# Altium schematic sheet Banker.schdoc: Banker
size 420 x 297 mm; Author: G.K.; CompanyName: WUT; DrawnBy: G.K.; Organization: CERN; Address1: Warsaw Univeristy of Technology; Address2: Nowowiejska 15/19; DocumentNumber: 1; Revision: -; SheetNumber: 1; SheetTotal: 9; EDA_Number: ARTIQ; Projet: Banker; ModifiedBy: -; CreateDate: XX/XX/XXXX; CheckedDate: -; Title2: Top; DivGrp: ISE; Designer: G.K.; ModifiedDate: -; ProjectName: ADC/DAC MEZZANINE
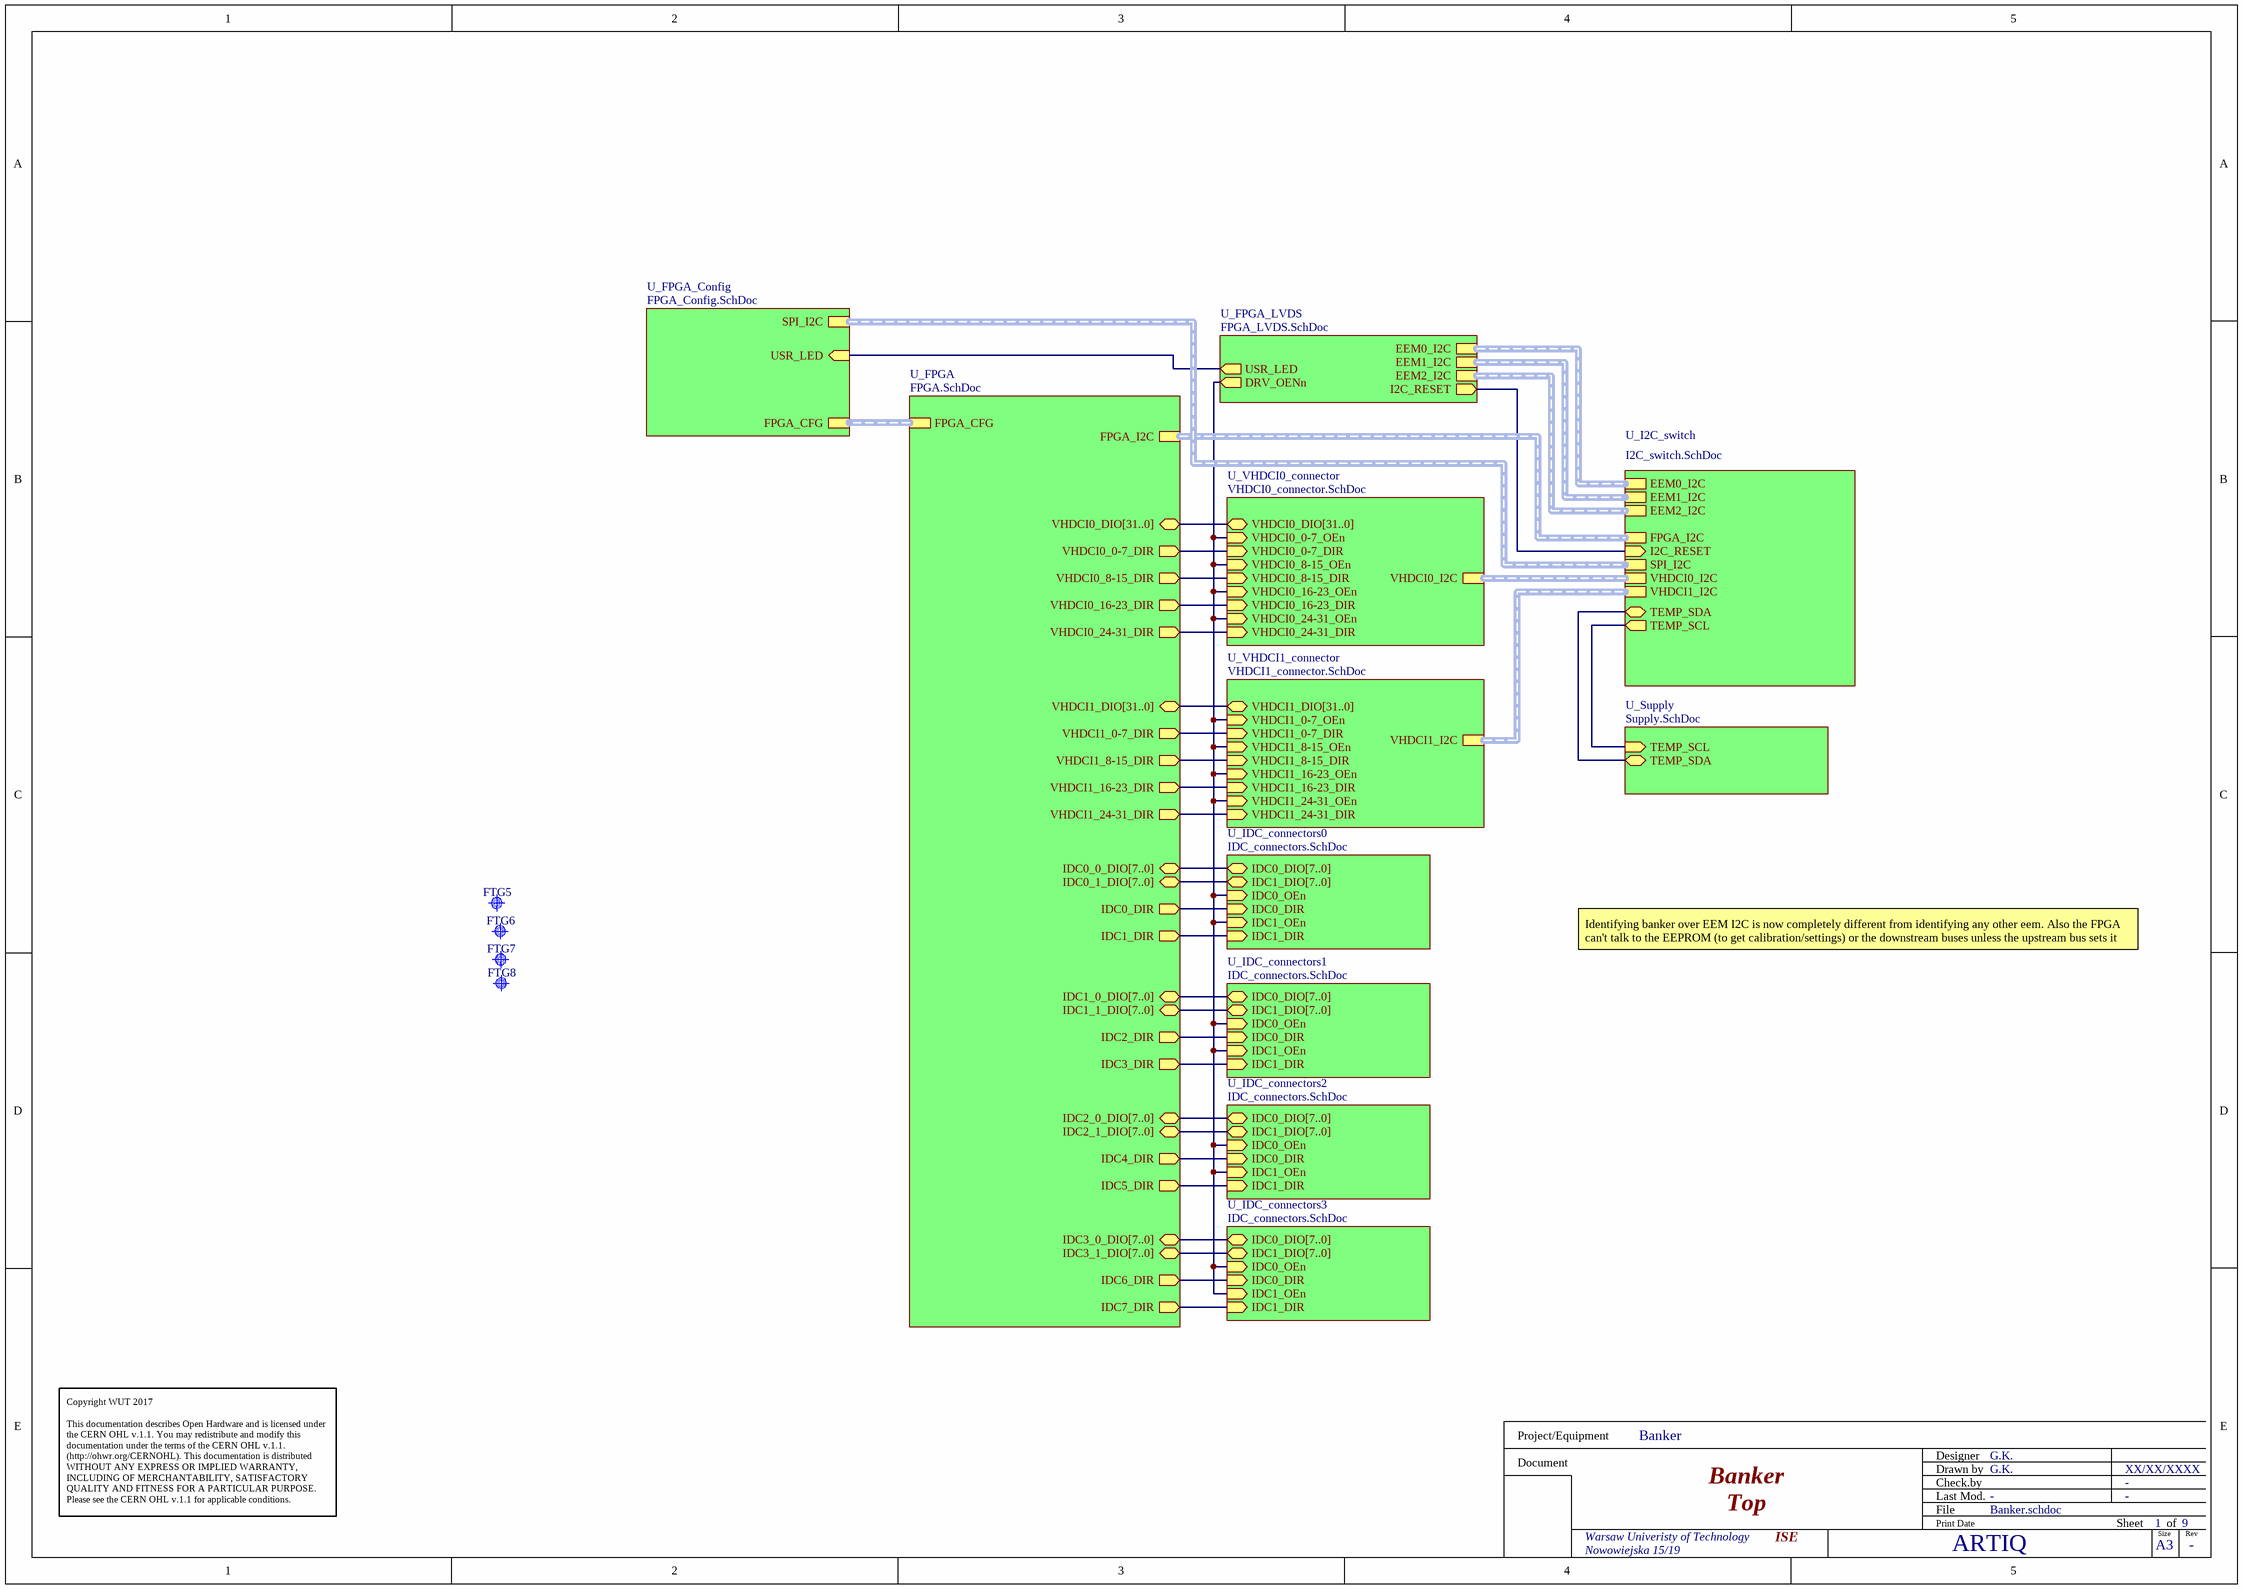
[diagram p0: Banker.schdoc]

## Parts
FTG5  Use only in PCB  [FIDUCIAL_TOP_C100-200]  (value not drawn)
FTG6  Use only in PCB  [FIDUCIAL_TOP_S100-200]  (value not drawn)
FTG7  Use only in PCB  [FIDUCIAL_TOP_S200-400]  (value not drawn)
FTG8  Use only in PCB  [FIDUCIAL_TOP_S100-200]  (value not drawn)

## Sub-sheets
U_FPGA = FPGA.SchDoc: VHDCI0_DIO[31..0] (bidir), VHDCI1_DIO[31..0] (bidir), IDC0_0_DIO[7..0] (bidir), IDC0_1_DIO[7..0] (bidir), IDC0_DIR (out), IDC1_DIR (out), VHDCI1_0-7_DIR (out), VHDCI1_8-15_DIR (out), VHDCI1_16-23_DIR (out), VHDCI1_24-31_DIR (out), VHDCI0_0-7_DIR (out), VHDCI0_8-15_DIR (out), VHDCI0_16-23_DIR (out), VHDCI0_24-31_DIR (out), IDC2_DIR (out), IDC3_DIR (out), IDC1_0_DIO[7..0] (bidir), IDC1_1_DIO[7..0] (bidir), IDC2_0_DIO[7..0] (bidir), IDC2_1_DIO[7..0] (bidir), IDC3_0_DIO[7..0] (bidir), IDC3_1_DIO[7..0] (bidir), IDC7_DIR (out), IDC6_DIR (out), IDC4_DIR (out), IDC5_DIR (out), FPGA_I2C (harness I2C), FPGA_CFG (harness FPGA_CFG)
U_FPGA_Config = FPGA_Config.SchDoc: FPGA_CFG (harness FPGA_CFG), SPI_I2C (harness I2C), USR_LED (in)
U_FPGA_LVDS = FPGA_LVDS.SchDoc: EEM0_I2C (harness I2C), EEM1_I2C (harness I2C), EEM2_I2C (harness I2C), USR_LED (out), I2C_RESET (out), DRV_OENn (out)
U_I2C_switch = I2C_switch.SchDoc: EEM0_I2C (harness I2C), EEM1_I2C (harness I2C), VHDCI0_I2C (harness I2C), VHDCI1_I2C (harness I2C), EEM2_I2C (harness I2C), FPGA_I2C (harness I2C), SPI_I2C (harness I2C), I2C_RESET (in), TEMP_SCL (out), TEMP_SDA (bidir)
U_IDC_connectors0 = IDC_connectors.SchDoc: IDC0_DIO[7..0] (bidir), IDC1_DIO[7..0] (bidir), IDC0_OEn (in), IDC0_DIR (in), IDC1_DIR (in), IDC1_OEn (in)
U_IDC_connectors1 = IDC_connectors.SchDoc: IDC0_DIO[7..0] (bidir), IDC1_DIO[7..0] (bidir), IDC0_OEn (in), IDC0_DIR (in), IDC1_DIR (in), IDC1_OEn (in)
U_IDC_connectors2 = IDC_connectors.SchDoc: IDC0_DIO[7..0] (bidir), IDC1_DIO[7..0] (bidir), IDC0_OEn (in), IDC0_DIR (in), IDC1_DIR (in), IDC1_OEn (in)
U_IDC_connectors3 = IDC_connectors.SchDoc: IDC0_DIO[7..0] (bidir), IDC1_DIO[7..0] (bidir), IDC0_OEn (in), IDC0_DIR (in), IDC1_DIR (in), IDC1_OEn (in)
U_Supply = Supply.SchDoc: TEMP_SCL (in), TEMP_SDA (bidir)
U_VHDCI0_connector = VHDCI0_connector.SchDoc: VHDCI0_I2C (harness I2C), VHDCI0_DIO[31..0] (bidir), VHDCI0_0-7_OEn (in), VHDCI0_0-7_DIR (in), VHDCI0_8-15_OEn (in), VHDCI0_8-15_DIR (in), VHDCI0_16-23_OEn (in), VHDCI0_16-23_DIR (in), VHDCI0_24-31_OEn (in), VHDCI0_24-31_DIR (in)
U_VHDCI1_connector = VHDCI1_connector.SchDoc: VHDCI1_DIO[31..0] (bidir), VHDCI1_I2C (harness I2C), VHDCI1_0-7_OEn (in), VHDCI1_0-7_DIR (in), VHDCI1_8-15_OEn (in), VHDCI1_8-15_DIR (in), VHDCI1_16-23_OEn (in), VHDCI1_16-23_DIR (in), VHDCI1_24-31_OEn (in), VHDCI1_24-31_DIR (in)

## Nets
(unnamed): sheet U_FPGA_LVDS/USR_LED, sheet U_FPGA_Config/USR_LED
(unnamed): sheet U_FPGA_LVDS/I2C_RESET, sheet U_I2C_switch/I2C_RESET
(unnamed): sheet U_FPGA_LVDS/DRV_OENn, sheet U_VHDCI0_connector/VHDCI0_0-7_OEn, sheet U_VHDCI0_connector/VHDCI0_8-15_OEn, sheet U_VHDCI0_connector/VHDCI0_16-23_OEn, sheet U_VHDCI0_connector/VHDCI0_24-31_OEn, sheet U_IDC_connectors0/IDC0_OEn, sheet U_IDC_connectors0/IDC1_OEn, sheet U_VHDCI1_connector/VHDCI1_0-7_OEn, sheet U_VHDCI1_connector/VHDCI1_8-15_OEn, sheet U_VHDCI1_connector/VHDCI1_16-23_OEn, sheet U_VHDCI1_connector/VHDCI1_24-31_OEn, sheet U_IDC_connectors1/IDC0_OEn, sheet U_IDC_connectors1/IDC1_OEn, sheet U_IDC_connectors2/IDC0_OEn, sheet U_IDC_connectors2/IDC1_OEn, sheet U_IDC_connectors3/IDC0_OEn, sheet U_IDC_connectors3/IDC1_OEn
(unnamed): sheet U_VHDCI0_connector/VHDCI0_0-7_DIR, sheet U_FPGA/VHDCI0_0-7_DIR
(unnamed): sheet U_VHDCI0_connector/VHDCI0_8-15_DIR, sheet U_FPGA/VHDCI0_8-15_DIR
(unnamed): sheet U_VHDCI0_connector/VHDCI0_16-23_DIR, sheet U_FPGA/VHDCI0_16-23_DIR
(unnamed): sheet U_VHDCI0_connector/VHDCI0_24-31_DIR, sheet U_FPGA/VHDCI0_24-31_DIR
(unnamed): sheet U_IDC_connectors0/IDC0_DIR, sheet U_FPGA/IDC0_DIR
(unnamed): sheet U_IDC_connectors0/IDC1_DIR, sheet U_FPGA/IDC1_DIR
(unnamed): sheet U_VHDCI1_connector/VHDCI1_0-7_DIR, sheet U_FPGA/VHDCI1_0-7_DIR
(unnamed): sheet U_VHDCI1_connector/VHDCI1_8-15_DIR, sheet U_FPGA/VHDCI1_8-15_DIR
(unnamed): sheet U_VHDCI1_connector/VHDCI1_16-23_DIR, sheet U_FPGA/VHDCI1_16-23_DIR
(unnamed): sheet U_VHDCI1_connector/VHDCI1_24-31_DIR, sheet U_FPGA/VHDCI1_24-31_DIR
(unnamed): sheet U_IDC_connectors1/IDC0_DIR, sheet U_FPGA/IDC2_DIR
(unnamed): sheet U_IDC_connectors1/IDC1_DIR, sheet U_FPGA/IDC3_DIR
(unnamed): sheet U_IDC_connectors2/IDC0_DIR, sheet U_FPGA/IDC4_DIR
(unnamed): sheet U_IDC_connectors2/IDC1_DIR, sheet U_FPGA/IDC5_DIR
(unnamed): sheet U_IDC_connectors3/IDC0_DIR, sheet U_FPGA/IDC6_DIR
(unnamed): sheet U_IDC_connectors3/IDC1_DIR, sheet U_FPGA/IDC7_DIR
(unnamed): sheet U_I2C_switch/TEMP_SCL, sheet U_Supply/TEMP_SCL
(unnamed): sheet U_I2C_switch/TEMP_SDA, sheet U_Supply/TEMP_SDA

## Buses and harness runs
bus sheet U_FPGA/IDC0_0_DIO[7..0] = sheet U_IDC_connectors0/IDC0_DIO[7..0]
bus sheet U_FPGA/IDC0_1_DIO[7..0] = sheet U_IDC_connectors0/IDC1_DIO[7..0]
bus sheet U_FPGA/IDC1_0_DIO[7..0] = sheet U_IDC_connectors1/IDC0_DIO[7..0]
bus sheet U_FPGA/IDC1_1_DIO[7..0] = sheet U_IDC_connectors1/IDC1_DIO[7..0]
bus sheet U_FPGA/IDC2_0_DIO[7..0] = sheet U_IDC_connectors2/IDC0_DIO[7..0]
bus sheet U_FPGA/IDC2_1_DIO[7..0] = sheet U_IDC_connectors2/IDC1_DIO[7..0]
bus sheet U_FPGA/IDC3_0_DIO[7..0] = sheet U_IDC_connectors3/IDC0_DIO[7..0]
bus sheet U_FPGA/IDC3_1_DIO[7..0] = sheet U_IDC_connectors3/IDC1_DIO[7..0]
bus sheet U_FPGA/VHDCI0_DIO[31..0] = sheet U_VHDCI0_connector/VHDCI0_DIO[31..0]
bus sheet U_FPGA/VHDCI1_DIO[31..0] = sheet U_VHDCI1_connector/VHDCI1_DIO[31..0]
harness sheet U_FPGA/FPGA_CFG = sheet U_FPGA_Config/FPGA_CFG
harness sheet U_FPGA/FPGA_I2C = sheet U_I2C_switch/FPGA_I2C
harness sheet U_FPGA_Config/SPI_I2C = sheet U_I2C_switch/SPI_I2C
harness sheet U_FPGA_LVDS/EEM0_I2C = sheet U_I2C_switch/EEM0_I2C
harness sheet U_FPGA_LVDS/EEM1_I2C = sheet U_I2C_switch/EEM1_I2C
harness sheet U_FPGA_LVDS/EEM2_I2C = sheet U_I2C_switch/EEM2_I2C
harness sheet U_I2C_switch/VHDCI0_I2C = sheet U_VHDCI0_connector/VHDCI0_I2C
harness sheet U_I2C_switch/VHDCI1_I2C = sheet U_VHDCI1_connector/VHDCI1_I2C

## Notes on the sheet
- Identifying banker over EEM I2C is now completely different from identifying any other eem. Also the FPGA can't talk to the EEPROM (to get calibration/settings) or the downstream buses unless the upstream bus sets it up.
- Copyright WUT 2017
  This documentation describes Open Hardware and is licensed under the CERN OHL v.1.1. You may redistribute and modify this documentation under the terms of the CERN OHL v.1.1. (http://ohwr.org/CERNOHL). This documentation is distributed WITHOUT ANY EXPRESS OR IMPLIED WARRANTY, INCLUDING OF MERCHANTABILITY, SATISFACTORY QUALITY AND FITNESS FOR A PARTICULAR PURPOSE. Please see the CERN OHL v.1.1 for applicable conditions.
- Project/Equipment
- Document
- Designer
- Drawn by
- Check.by
- File
- Last Mod.
- Print Date
- Sheet
- Size
- A3
- of
- Rev

## Library data of the parts
FTG5 = FIDUCIAL_TARGET_C100-200: Fiducial Target; Part Description: Round Fiducial Target, Top Layer, 1.0mm, Top Solder 2.0mm, Keepout =2.0mm; Mounted: No; Part Number: FIDUCIAL_TARGET_C100-200; Component Kind: Standard (No BOM); Component Type: Standard (No BOM); Pin Count: 1; Family: Fiducial; Socket: No; SMD: Yes; Sense: No; Status: None; ComponentHeight: 0mm; HelpURL: Undefined; Author: CERN DEM JLC; CreateDate: 09.02.2010; LatestRevisionDate: 04.04.2012; PackageDescription: Round Fiducial Target, Top Layer, 1.0mm, Top Solder 2.0mm, Keepout =2.0mm
FTG6 FTG8 = FIDUCIAL_TARGET_S100-200: Fiducial Target; Part Description: Square Fiducial Target, Top Layer, 1.0mm, Top Solder 2.0mm, Keepout =2.0mm; Mounted: No; Part Number: FIDUCIAL_TARGET_S100-200; Component Kind: Standard (No BOM); Component Type: Standard (No BOM); Pin Count: 1; Family: Fiducial; Socket: No; SMD: Yes; Sense: No; Status: None; ComponentHeight: 0mm; HelpURL: Undefined; Author: CERN DEM JLC; CreateDate: 09.02.2010; LatestRevisionDate: 04.04.2012; PackageDescription: Square Fiducial Target, Top Layer, 1.0mm, Top Solder 2.0mm, Keepout =2.0mm
FTG7 = FIDUCIAL_TARGET_S200-400: Fiducial Target; Part Description: Square Fiducial Target, Top Layer, 2.0mm, Top Solder 4.0mm, Keepout =4.0mm; Mounted: No; Part Number: FIDUCIAL_TARGET_S200-400; Component Kind: Standard (No BOM); Component Type: Standard (No BOM); Pin Count: 1; Family: Fiducial; Socket: No; SMD: Yes; Sense: No; Status: None; ComponentHeight: 0mm; HelpURL: Undefined; Author: CERN DEM JLC; CreateDate: 02.06.2008; LatestRevisionDate: 04.04.2012; PackageDescription: Square Fiducial Target, Top Layer, 2.0mm, Top Solder 4.0mm, Keepout =4.0mm